# EAGLE design displaycontrol (EAGLE 6.5.2)
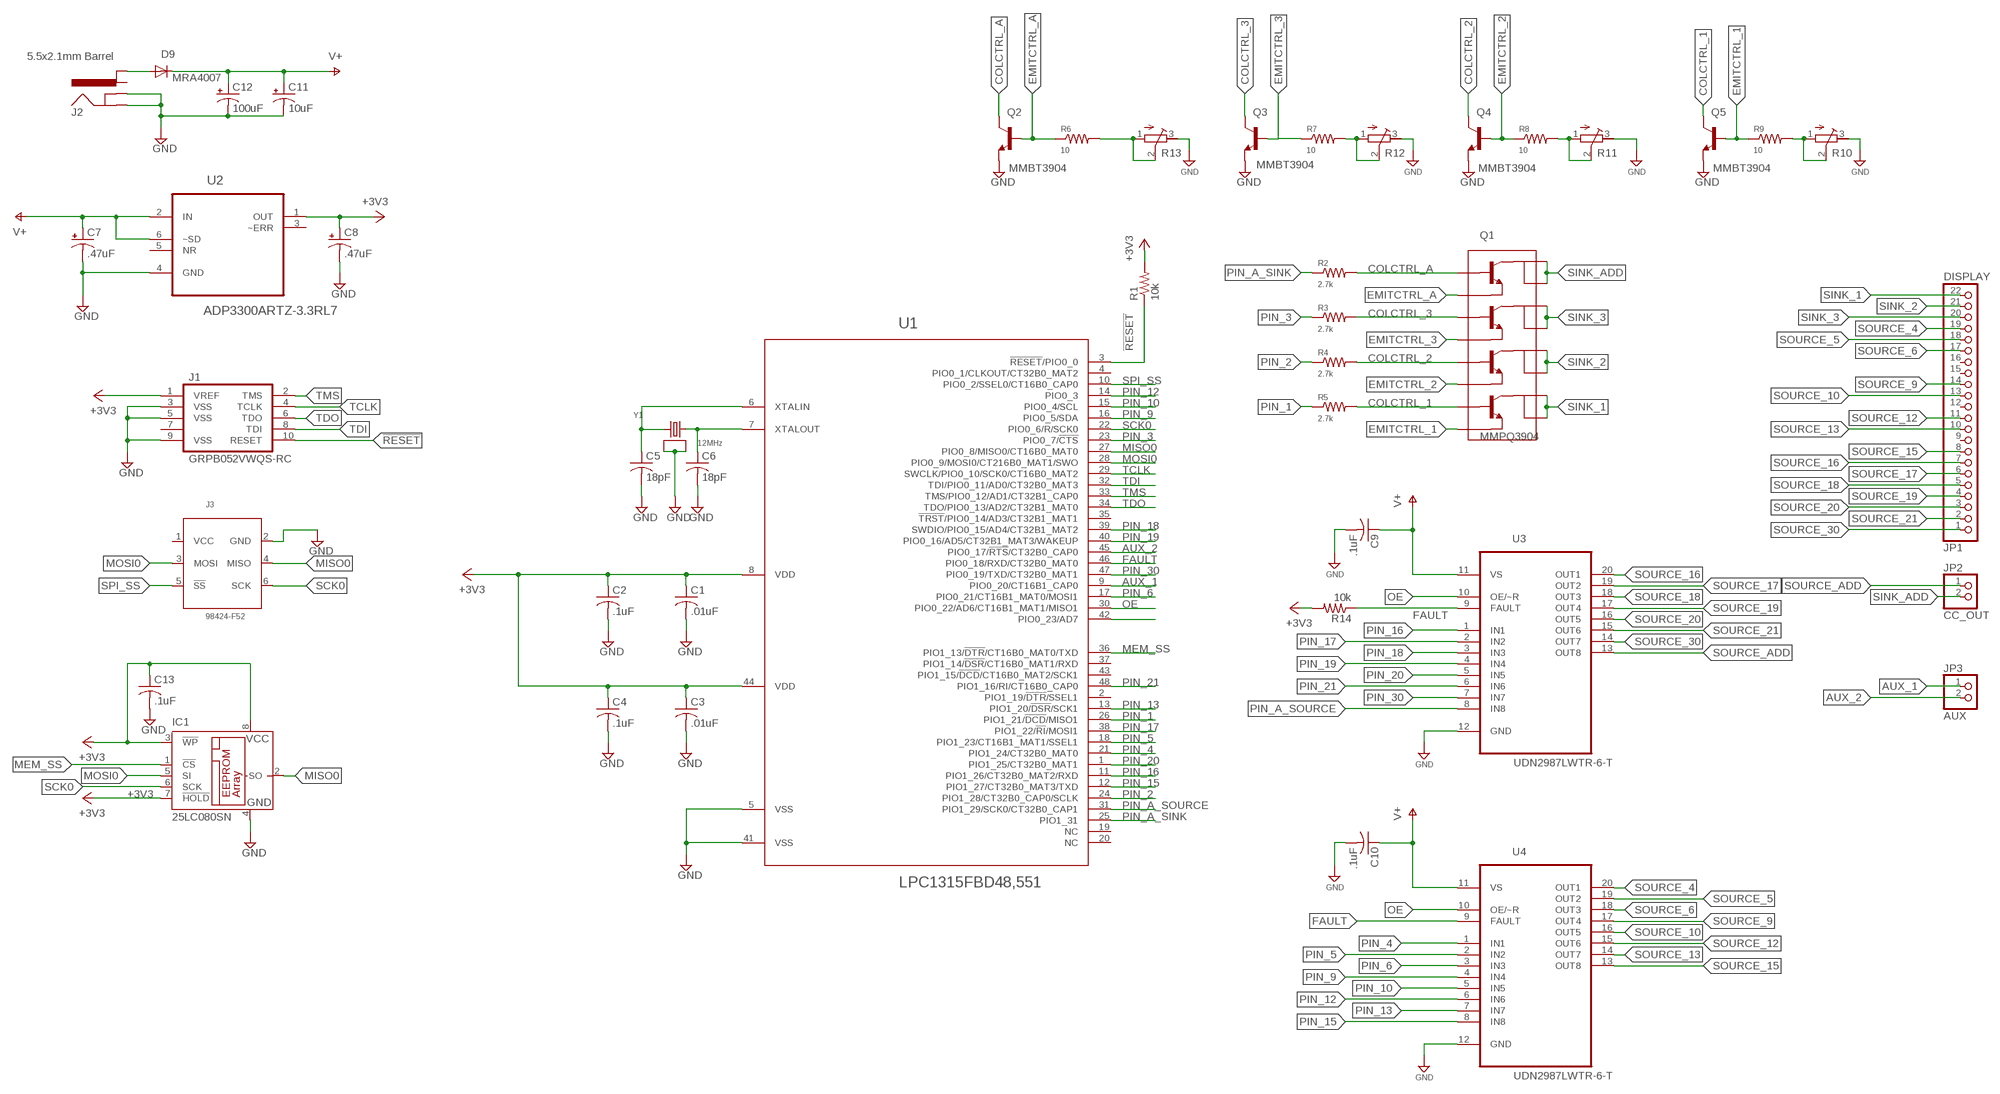
[diagram p0: schematic, sheet 1]

## Parts
C1  .01uF  C-USC0805  [C0805]
C2  .1uF  C-USC0805  [C0805]
C3  .01uF  C-USC0805  [C0805]
C4  .1uF  C-USC0805  [C0805]
C5  18pF  C-USC0805  [C0805]
C6  18pF  C-USC0805  [C0805]
C7  .47uF  CAP_POL1206  [EIA3216]
C8  .47uF  CAP_POL1206  [EIA3216]
C9  .1uF  C-USC0805  [C0805]
C10  .1uF  C-USC0805  [C0805]
C11  10uF  CPOL-US153CLV-0405  [153CLV-0405]
C12  100uF  CPOL-US153CLV-0605  [153CLV-0605]
C13  .1uF  C-USC0805  [C0805]
D9  MRA4007  CGRM4007-G  [SOD-123_MINI-SMA]
IC1  25LC080SN  [SO-08]
J1  GRPB052VWQS-RC  [GRPB052VWQS-RC]
J2  5.5x2.1mm Barrel  POWER_JACKSMD  [POWER_JACK_SMD]
J3  98424-F52  [2X3_2MM_SMD]
JP1  DISPLAY  PINHD-1X22  [1X22]
JP2  CC_OUT  PINHD-1X2  [1X02]
JP3  AUX  PINHD-1X2  [1X02]
Q1  MMPQ3904  [SO16]
Q2  MMBT3904  TRANSISTOR_NPNMMBT2222A  [SOT23-3]
Q3  MMBT3904  TRANSISTOR_NPNMMBT2222A  [SOT23-3]
Q4  MMBT3904  TRANSISTOR_NPNMMBT2222A  [SOT23-3]
Q5  MMBT3904  TRANSISTOR_NPNMMBT2222A  [SOT23-3]
R1  10k  R-US_R0805  [R0805]
R2  2.7k  R-US_R0805  [R0805]
R3  2.7k  R-US_R0805  [R0805]
R4  2.7k  R-US_R0805  [R0805]
R5  2.7k  R-US_R0805  [R0805]
R6  10  R-US_R0805  [R0805]
R7  10  R-US_R0805  [R0805]
R8  10  R-US_R0805  [R0805]
R9  10  R-US_R0805  [R0805]
R10  R-TRIMM3214W  [RTRIM3214W]
R11  R-TRIMM3214W  [RTRIM3214W]
R12  R-TRIMM3214W  [RTRIM3214W]
R13  R-TRIMM3214W  [RTRIM3214W]
R14  10k  R-US_R0805  [R0805]
U1  LPC1315FBD48,551  [QFP50P900X900X160-48N]
U2  ADP3300ARTZ-3.3RL7  [SOT95P275X145-6N]
U3  UDN2987LWTR-6-T  [SO20W]
U4  UDN2987LWTR-6-T  [SO20W]
Y1  12MHz  CRYSTAL.5X3.2MM  [5X3.2MM]

## Nets
!RESET!: J1.10(RESET) R1.1 U1.3(!RESET!/PIO0_0)
+3V3: C1.1 C2.1 C3.1 C4.1 C8.A(+) C13.1 IC1.3(!WP) IC1.7(!HOLD) IC1.8(VCC) J1.1(VREF) R1.2 R14.2 U1.8(VDD) U1.44(VDD) U2.1(OUT)
AUX_1: JP3.1 U1.9(PIO0_20/CT16B1_CAP0)
AUX_2: JP3.2 U1.45(PIO0_17/!RTS!/CT32B0_CAP0)
COLCTRL_1: Q1.9(B4) Q5.3(C) R5.2
COLCTRL_2: Q1.11(B3) Q4.3(C) R4.2
COLCTRL_3: Q1.13(B2) Q3.3(C) R3.2
COLCTRL_A: Q1.15(B1) Q2.3(C) R2.2
EMITCTRL_1: Q1.10(E4) Q5.1(B) R9.1
EMITCTRL_2: Q1.12(E3) Q4.1(B) R8.1
EMITCTRL_3: Q1.14(E2) Q3.1(B) R7.1
EMITCTRL_A: Q1.16(E1) Q2.1(B) R6.1
FAULT: R14.1 U1.46(PIO0_18/RXD/CT32B0_MAT0) U3.9(FAULT) U4.9(FAULT)
GND: C1.2 C2.2 C3.2 C4.2 C5.2 C6.2 C7.C(-) C8.C(-) C9.2 C10.2 C11.- C12.- C13.2 IC1.4(GND) J1.3(VSS) J1.5(VSS) J1.9(VSS) J2.GND(GNDBREAK) J2.P$4(GND) J3.2(GND) Q2.2(E) Q3.2(E) Q4.2(E) Q5.2(E) R10.3(A) R11.3(A) R12.3(A) R13.3(A) U1.5(VSS) U1.41(VSS) U2.4(GND) U3.12(GND) U4.12(GND) Y1.2(GND) Y1.4(GND)
MEM_SS: IC1.1(!CS) U1.36(PIO1_13/!DTR!/CT16B0_MAT0/TXD)
MISO0: IC1.2(SO) J3.4(MISO) U1.27(PIO0_8/MISO0/CT16B0_MAT0)
MOSI0: IC1.5(SI) J3.3(MOSI) U1.28(PIO0_9/MOSI0/CT216B0_MAT1/SWO)
N$1: C6.1 U1.7(XTALOUT) Y1.3
N$2: C5.1 U1.6(XTALIN) Y1.1
N$6: U1.42(PIO0_23/AD7)
N$13: R6.2 R13.1(E) R13.2(S)
N$18: R7.2 R12.1(E) R12.2(S)
N$20: R8.2 R11.1(E) R11.2(S)
N$22: R9.2 R10.1(E) R10.2(S)
N$42: D9.A J2.VIN1(PWR1)
OE: U1.30(PIO0_22/AD6/CT16B1_MAT1/MISO1) U3.10(OE/~R) U4.10(OE/~R)
PIN_1: R5.1 U1.26(PIO1_21/!DCD!/MISO1)
PIN_2: R4.1 U1.24(PIO1_28/CT32B0_CAP0/SCLK)
PIN_3: R3.1 U1.23(PIO0_7/!CTS!)
PIN_4: U1.21(PIO1_24/CT32B0_MAT0) U4.1(IN1)
PIN_5: U1.18(PIO1_23/CT16B1_MAT1/SSEL1) U4.2(IN2)
PIN_6: U1.17(PIO0_21/CT16B1_MAT0/MOSI1) U4.3(IN3)
PIN_9: U1.16(PIO0_5/SDA) U4.4(IN4)
PIN_10: U1.15(PIO0_4/SCL) U4.5(IN5)
PIN_12: U1.14(PIO0_3) U4.6(IN6)
PIN_13: U1.13(PIO1_20/!DSR!/SCK1) U4.7(IN7)
PIN_15: U1.12(PIO1_27/CT32B0_MAT3/TXD) U4.8(IN8)
PIN_16: U1.11(PIO1_26/CT32B0_MAT2/RXD) U3.1(IN1)
PIN_17: U1.38(PIO1_22/!RI!/MOSI1) U3.2(IN2)
PIN_18: U1.39(SWDIO/PIO0_15/AD4/CT32B1_MAT2) U3.3(IN3)
PIN_19: U1.40(PIO0_16/AD5/CT32B1_MAT3/WAKEUP) U3.4(IN4)
PIN_20: U1.1(PIO1_25/CT32B0_MAT1) U3.5(IN5)
PIN_21: U1.48(PIO1_16/RI/CT16B0_CAP0) U3.6(IN6)
PIN_30: U1.47(PIO0_19/TXD/CT32B0_MAT1) U3.7(IN7)
PIN_A_SINK: R2.1 U1.25(PIO1_31)
PIN_A_SOURCE: U1.31(PIO1_29/SCK0/CT32B0_CAP1) U3.8(IN8)
SCK0: IC1.6(SCK) J3.6(SCK) U1.22(PIO0_6/R/SCK0)
SINK_1: JP1.22 Q1.7(C4) Q1.8(C4)
SINK_2: JP1.21 Q1.5(C3) Q1.6(C3)
SINK_3: JP1.20 Q1.3(C2) Q1.4(C2)
SINK_ADD: JP2.2 Q1.1(C1) Q1.2(C1)
SOURCE_4: JP1.19 U4.20(OUT1)
SOURCE_5: JP1.18 U4.19(OUT2)
SOURCE_6: JP1.17 U4.18(OUT3)
SOURCE_9: JP1.14 U4.17(OUT4)
SOURCE_10: JP1.13 U4.16(OUT5)
SOURCE_12: JP1.11 U4.15(OUT6)
SOURCE_13: JP1.10 U4.14(OUT7)
SOURCE_15: JP1.8 U4.13(OUT8)
SOURCE_16: JP1.7 U3.20(OUT1)
SOURCE_17: JP1.6 U3.19(OUT2)
SOURCE_18: JP1.5 U3.18(OUT3)
SOURCE_19: JP1.4 U3.17(OUT4)
SOURCE_20: JP1.3 U3.16(OUT5)
SOURCE_21: JP1.2 U3.15(OUT6)
SOURCE_30: JP1.1 U3.14(OUT7)
SOURCE_ADD: JP2.1 U3.13(OUT8)
SPI_SS: J3.5(!SS!) U1.10(PIO0_2/SSEL0/CT16B0_CAP0)
TCLK: J1.4(TCLK) U1.29(SWCLK/PIO0_10/SCK0/CT16B0_MAT2)
TDI: J1.8(TDI) U1.32(TDI/PIO0_11/AD0/CT32B0_MAT3)
TDO: J1.6(TDO) U1.34(TDO/PIO0_13/AD2/CT32B1_MAT0)
TMS: J1.2(TMS) U1.33(TMS/PIO0_12/AD1/CT32B1_CAP0)
V+: C7.A(+) C9.1 C10.1 C11.+ C12.+ D9.C U2.2(IN) U2.6(~SD) U3.11(VS) U4.11(VS)
Unconnected: J1.7(NC) J2.VIN0(PWR) JP1.9 JP1.12 JP1.15 JP1.16 U1.2(PIO1_19/!DTR!/SSEL1) U1.4(PIO0_1/CLKOUT/CT32B0_MAT2) U1.19(NC) U1.20(NC) U1.35(!TRST!/PIO0_14/AD3/CT32B1_MAT1) U1.37(PIO1_14/!DSR!/CT16B0_MAT1/RXD) U1.43(PIO1_15/!DCD!/CT16B0_MAT2/SCK1) U2.3(~ERR) U2.5(NR)

## Power pins joined to a net without a drawn wire
VCC: J3.1(VCC)

## Library data of the parts
C1-C6 C9 C10 C13 = rcl:C-US: CAPACITOR, American symbol
C7 C8 = SparkFun-Capacitors:CAP_POL: Capacitor Polarized These are standard SMD and PTH capacitors. Normally 10uF, 47uF, and 100uF in electrolytic and tantalum varieties. Always verify the external diameter of the through hole cap, it varies with capacity, voltage, and manufacturer. The EIA devices should be standard.
C11 C12 = rcl:CPOL-US: POLARIZED CAPACITOR, American symbol
D9 = diode:CGRM400*-G: Molded plasitc,JEDEC SOD-123/Mini SMA Source: Comchip CGRM4001-G.pdf
IC1 = microchip:25*: Serial EEPROM 4K/ 8K , SPI bus; MF: MICROCHIP; MPN: 25LC080/SN; OC_FARNELL: 1137302; OC_NEWARK: 96K4092
J1 = switchers:GRPB052VWQS-RC: HEADER - Vertical, Shrouded
J2 = SparkFun-Connectors:POWER_JACK: Power Jack This is the standard 5.5mm barrel jack for power. The PTH is the most common, proven, reliable, footprint. The Slot footprint only works if the mill layer is transmitted to the PCB fab house so be warned. Spark Fun Electronics SKU : PRT-00119 SMT: CONN-08106 Mating wall wart : TOL-00298 (and others); PROD_ID: CONN-08106
J3 = switchers:98424-F52
JP1 = pinhead:PINHD-1X22: PIN HEADER
JP2 JP3 = pinhead:PINHD-1X2: PIN HEADER
Q1 = switchers:MMPQ3904
Q2-Q5 = SparkFun-DiscreteSemi:TRANSISTOR_NPN: Generic NPN BJT MMBT2222A - TRANS-08049 (SOT-23, 1A 40V) MPSA42 - TRANS-09116 (SOT-23, 500mA 300V) MMBT5088LT1G - TRANS-11160 (SOT-23, 50 mA 30V); PROD_ID: TRANS-08049; VALUE: MMBT2222A
R1-R9 R14 = rcl:R-US_: RESISTOR, American symbol
R10-R13 = resistor:R-TRIMM: Trimm resistor
U1 = switchers:LPC1315FBD48,551
U2 = switchers:ADP3300ARTZ-3.3RL7: Low Dropout Linear Regulator; MPN: ADP3300ARTZ-3.3RL7; OC_FARNELL: 1661067; OC_NEWARK: 19M8715; PACKAGE: TSOT-6; SUPPLIER: ANALOG DEVICES
U3 U4 = switchers:UDN2987LWTR-6-T: 8-CHANNEL SOURCE DRIVER WITH OVER-CURRENT PROTECTION
Y1 = abracon:CRYSTAL

## Board
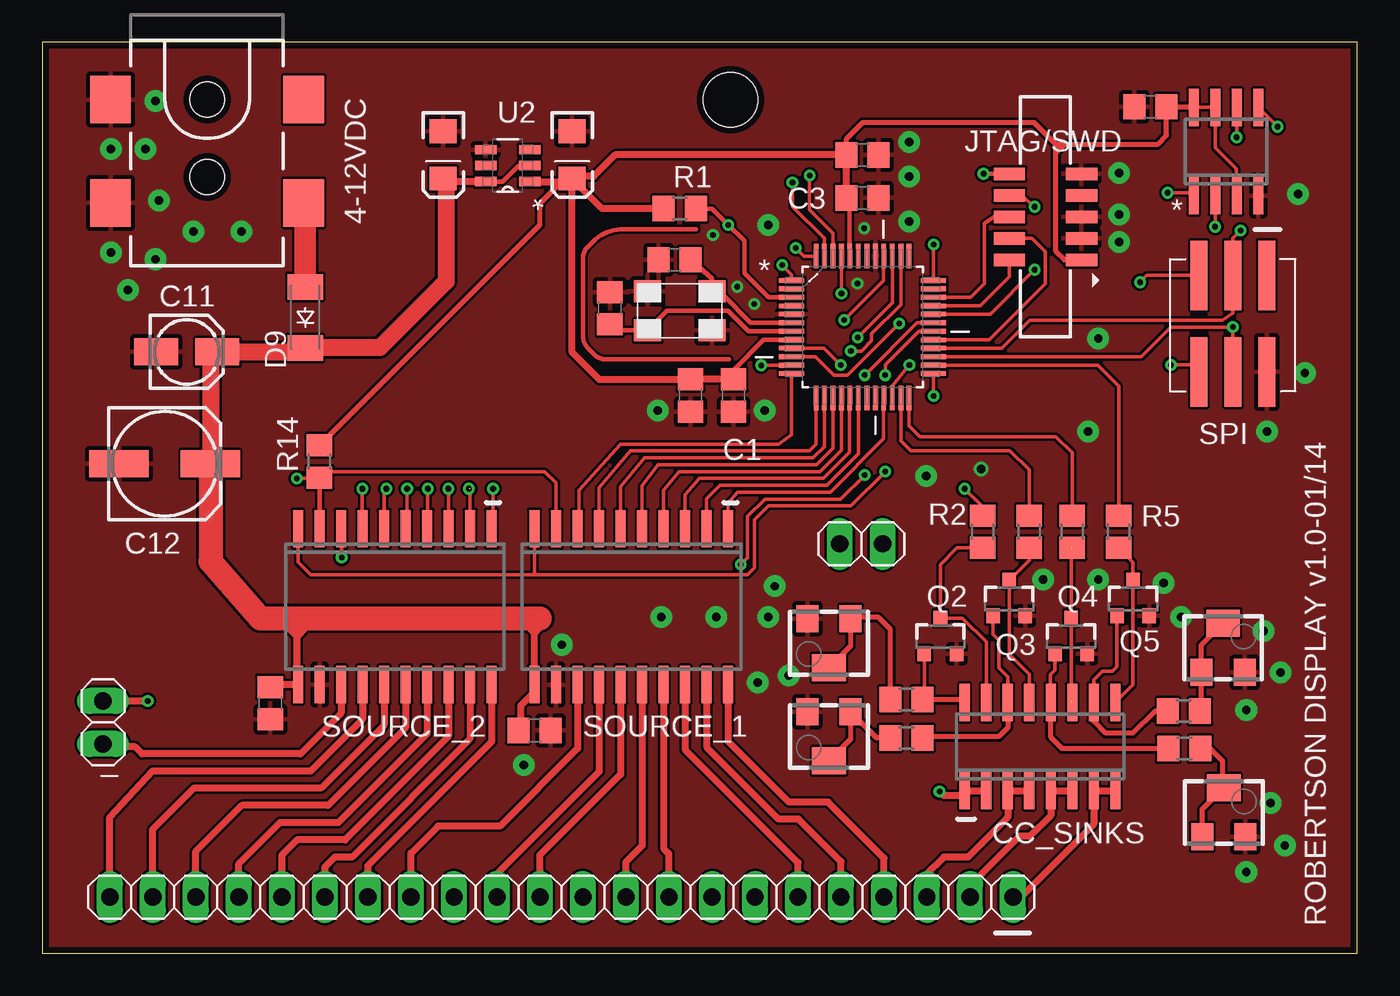
[diagram p1: board, top side]
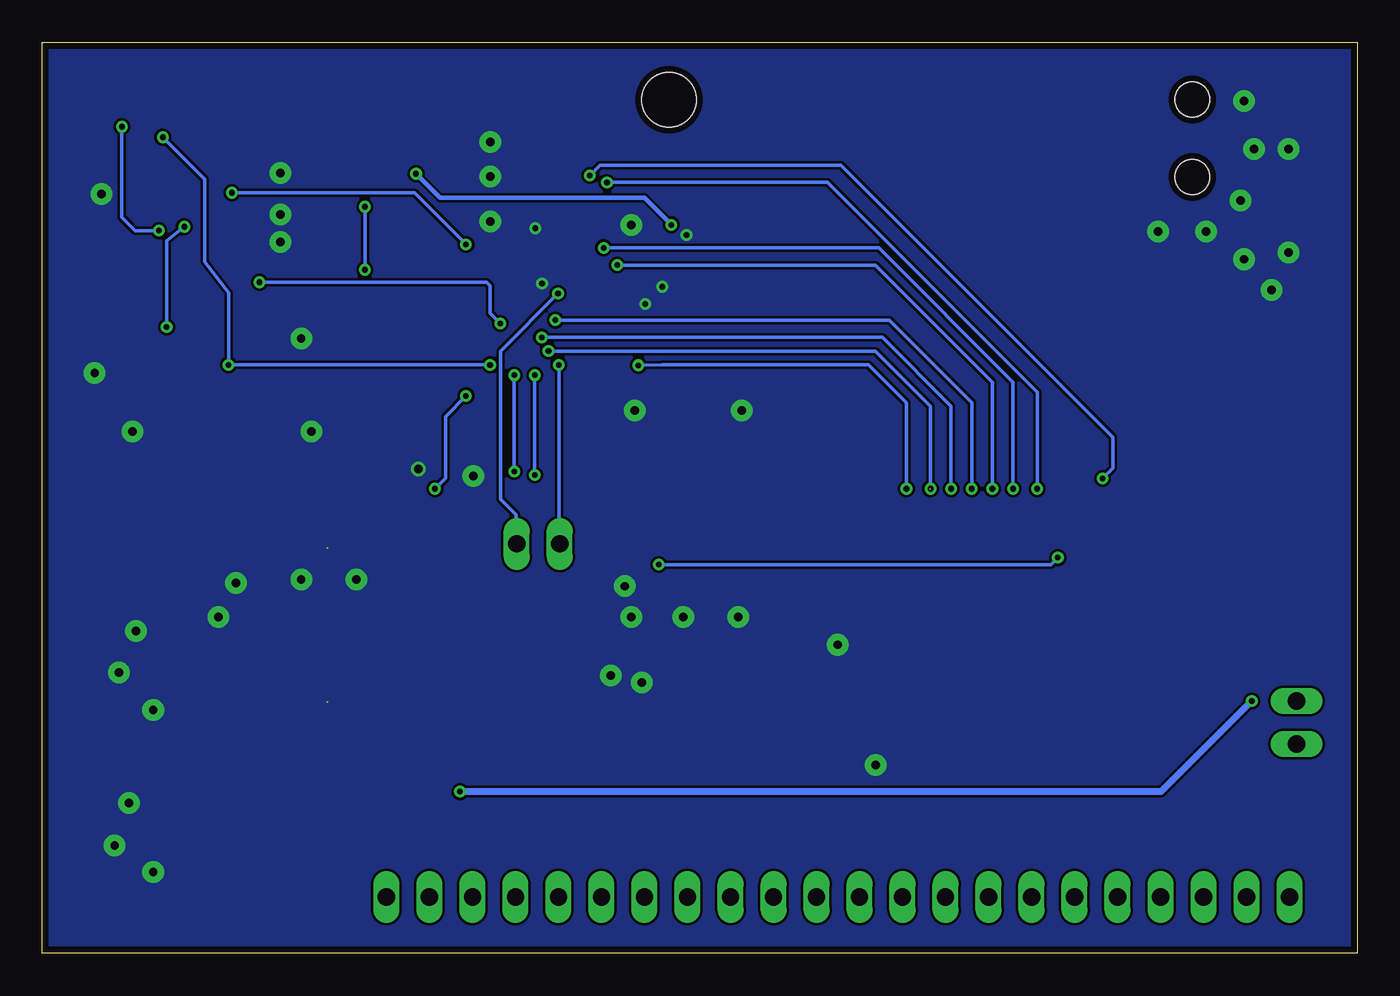
[diagram p2: board, bottom side, seen from below]

Size 77.65 x 53.79 mm. Coordinates in mm from the lower left corner, seen from the top.
Outline: 0,0 77.65,0 77.65,53.79 0,53.79 0,0
Copper layers (1*16): Top 0.0356mm / dielectric 1.5011mm / Bottom 0.0356mm
Design rules "LaenPCBOrder": minimum track width 6mil, minimum drill 13mil, track to track 6mil, track to pad 6mil, pad to pad 6mil, via to via 6mil, smd to smd 6mil, copper to edge 15mil, drill to drill 6mil, minimum pad ring 7mil, minimum via ring 7mil, stop-mask expansion 3mil, vias tented up to drill 0mil, thermal gap 10mil
Holes 3.2 mm at 40.64,50.39

### Footprints (pad centres in the part's own frame; a part is rotated, then mirrored left to right if it is on the bottom)
C0805 = smd 1.3 x 1.5: 1 -0.95,0; 2 0.95,0
EIA3216 = smd 1.4 x 1.6: A 1.4,0; C -1.4,0
153CLV-0405 = smd 2.6 x 1.6: + 1.8,0; - -1.8,0
153CLV-0605 = smd 3.5 x 1.6: + 2.7,0; - -2.7,0
SOD-123_MINI-SMA = smd 1.5 x 2.1: A 1.8,0; C -1.8,0
SO-08 = smd 0.6 x 2.2: 1 -1.905,-2.6; 2 -0.635,-2.6; 3 0.635,-2.6; 4 1.905,-2.6; 5 1.905,2.6; 6 0.635,2.6; 7 -0.635,2.6; 8 -1.905,2.6
GRPB052VWQS-RC = smd 0.74 x 1.85: 1 -2.54,-2.156; 2 -2.54,2.106; 3 -1.27,-2.156; 4 -1.27,2.106; 5 0,-2.156; 6 0,2.106; 7 1.27,-2.156; 8 1.27,2.106; 9 2.54,-2.156; 10 2.54,2.106
POWER_JACK_SMD = smd 2.8 x 2.4: GND 0,-5.7; P$4 6.1,-5.7; VIN0 0,5.7; VIN1 6.1,5.7 | hole 2.032: 0,0; 4.572,0
2X3_2MM_SMD = smd 1 x 4.1: 1 -2,-2.85; 2 -2,2.85; 3 0,-2.85; 4 0,2.85; 5 2,-2.85; 6 2,2.85
1X22 = drill 1.016 long: 1 -26.67,0; 2 -24.13,0; 3 -21.59,0; 4 -19.05,0; 5 -16.51,0; 6 -13.97,0; 7 -11.43,0; 8 -8.89,0; 9 -6.35,0; 10 -3.81,0; 11 -1.27,0; 12 1.27,0; 13 3.81,0; 14 6.35,0; 15 8.89,0; 16 11.43,0; 17 13.97,0; 18 16.51,0; 19 19.05,0; 20 21.59,0; 21 24.13,0; 22 26.67,0
1X02 = drill 1.016 long: 1 -1.27,0; 2 1.27,0
SO16 = smd 0.6 x 2.2: 1 -4.445,-2.6; 2 -3.175,-2.6; 3 -1.905,-2.6; 4 -0.635,-2.6; 5 0.635,-2.6; 6 1.905,-2.6; 7 3.175,-2.6; 8 4.445,-2.6; 9 4.445,2.6; 10 3.175,2.6; 11 1.905,2.6; 12 0.635,2.6; 13 -0.635,2.6; 14 -1.905,2.6; 15 -3.175,2.6; 16 -4.445,2.6
SOT23-3 = smd 0.8 x 0.9: 1 -0.95,-1; 2 0.95,-1; 3 0,1.1
R0805 = smd 1.3 x 1.5: 1 -0.95,0; 2 0.95,0
RTRIM3214W = smd 1.3 x 1.6: 1 -1.275,-1.45; 3 1.275,-1.45 | smd 2 x 1.6: 2 0,1.45
QFP50P900X900X160-48N = smd 1.473 x 0.279: 1 -4.191,2.743; 2 -4.191,2.261; 3 -4.191,1.753; 4 -4.191,1.245; 5 -4.191,0.762; 6 -4.191,0.254; 7 -4.191,-0.254; 8 -4.191,-0.762; 9 -4.191,-1.245; 10 -4.191,-1.753; 11 -4.191,-2.261; 12 -4.191,-2.743; 25 4.191,-2.743; 26 4.191,-2.261; 27 4.191,-1.753; 28 4.191,-1.245; 29 4.191,-0.762; 30 4.191,-0.254; 31 4.191,0.254; 32 4.191,0.762; 33 4.191,1.245; 34 4.191,1.753; 35 4.191,2.261; 36 4.191,2.743 | smd 0.279 x 1.473: 13 -2.743,-4.191; 14 -2.261,-4.191; 15 -1.753,-4.191; 16 -1.245,-4.191; 17 -0.762,-4.191; 18 -0.254,-4.191; 19 0.254,-4.191; 20 0.762,-4.191; 21 1.245,-4.191; 22 1.753,-4.191; 23 2.261,-4.191; 24 2.743,-4.191; 37 2.743,4.191; 38 2.261,4.191; 39 1.753,4.191; 40 1.245,4.191; 41 0.762,4.191; 42 0.254,4.191; 43 -0.254,4.191; 44 -0.762,4.191; 45 -1.245,4.191; 46 -1.753,4.191; 47 -2.261,4.191; 48 -2.743,4.191
SOT95P275X145-6N = smd 1.27 x 0.559: 1 -1.295,0.94; 2 -1.295,0; 3 -1.295,-0.94; 4 1.295,-0.94; 5 1.295,0; 6 1.295,0.94
SO20W = smd 0.6 x 2.2: 1 -5.715,-4.6; 2 -4.445,-4.6; 3 -3.175,-4.6; 4 -1.905,-4.6; 5 -0.635,-4.6; 6 0.635,-4.6; 7 1.905,-4.6; 8 3.175,-4.6; 9 4.445,-4.6; 10 5.715,-4.6; 11 5.715,4.6; 12 4.445,4.6; 13 3.175,4.6; 14 1.905,4.6; 15 0.635,4.6; 16 -0.635,4.6; 17 -1.905,4.6; 18 -3.175,4.6; 19 -4.445,4.6; 20 -5.715,4.6
5X3.2MM = smd 1.6 x 1.3: 1 -1.9,-1.15; 2 1.9,-1.15; 3 1.9,1.15; 4 -1.9,1.15

### Placement (x,y rotation side)
C1  40.82,32.94 270 top
C2  38.28,32.94 270 top
C3  48.44,44.6 0 top
C4  48.44,47.14 0 top
C5  37.33,40.95 180 top
C6  33.52,38.09 90 top
C7  23.67,47.14 270 top
C8  31.29,47.14 270 top
C9  13.46,14.77 270 top
C10  29.07,13.17 0 top
C11  8.53,35.51 0 top
C12  7.23,28.91 0 top
C13  65.43,49.99 180 top
D9  15.53,37.55 90 top
IC1  69.9,47.35 0 top
J1  59.21,43.49 90 top
J2  9.73,50.41 270 top
J3  70.31,37.19 180 top
JP1  30.66,3.33 0 top
JP2  3.58,13.64 90 top
JP3  48.36,24.18 0 top
Q1  58.92,12.22 0 top
Q2  53.04,18.69 0 top
Q3  57.1,20.93 0 top
Q4  60.76,18.69 0 top
Q5  64.41,20.93 0 top
R1  37.64,43.97 180 top
R2  55.54,24.89 270 top
R3  58.28,24.89 270 top
R4  60.82,24.89 270 top
R5  63.56,24.89 270 top
R6  51.03,14.99 180 top
R7  51.03,12.73 180 top
R8  67.44,12.1 0 top
R9  67.42,14.31 0 top
R10  69.73,18.05 0 top
R11  69.78,8.33 0 top
R12  46.46,12.82 180 top
R13  46.46,18.32 180 top
R14  16.37,29.04 90 top
U1  48.44,36.98 0 top
U2  27.48,46.51 180 top
U3  20.82,20.47 180 top
U4  34.79,20.47 180 top
Y1  37.64,37.93 180 top

### Tracks (layer width: path | path; a pad name or v marks a point on that pad's centre or on a via)
!RESET!  (via drill 0.33 pad 0.18)
  Top 0.254: U1.3 42.88,38.73 41.45,40.16 41.45,42.06 v40.5,43.02 39.55,43.97 R1.1 | J1.10 v55.58,46.03
  Bottom 0.254: v55.58,46.03 54.15,44.6 42.09,44.6 v40.5,43.02
+3V3
  Top 0.203: IC1.8 IC1.7 69.27,47.57 70.51,46.33 70.51,44.77 IC1.3
  Top 0.254: U1.8 42.6,36.22 40.82,34.44 C1.1 | U1.44 47.68,44.41
  Top 0.305: 47.68,44.41 C3.1 | C4.1 47.49,48.1 48.44,49.05 58.6,49.05 59.87,47.78 | J1.1 60.35,40.95 59.87,41.43 59.87,47.78 | R14.2 29.39,43.01 29.39,44.3 30.66,45.57 | 60.35,47.75 65.84,47.75 66.38,48.3 C13.1 67.95,49.99 IC1.8 | 60.35,47.75 59.89,47.75 59.87,47.78 | 59.94,47.35 60.35,47.75
  Top 0.406: C1.1 C2.1 32.88,33.89 31.29,35.48 C8.A | C3.1 C4.1 33.83,47.14 32.56,45.87 31.42,45.87 C8.A | U2.1 30.66,45.57 31.12,45.57 C8.A | R1.2 33.07,43.97 C8.A
AUX_1  (via drill 0.33)
  Top 0.203: U1.9 46.15,35.74 v47.14,34.75
  Bottom 0.203: v47.14,34.75 47.14,24.23 JP3.1
AUX_2  (via drill 0.33)
  Top 0.203: U1.45 v47.19,38.96
  Bottom 0.203: v47.19,38.96 50.6,35.56 50.6,26.82 49.68,25.91 49.68,24.23 JP3.2
COLCTRL_1
  Top 0.203: R5.2 64.41,23.09 Q5.3 64.41,15.87 Q1.9
COLCTRL_2  (2 unrouted)
  Top 0.203: 60.76,23.88 Q4.3 60.76,14.88
COLCTRL_3
  Top 0.203: R3.2 58.28,23.21 Q3.3 57.1,17.68 58.28,16.5 Q1.13
COLCTRL_A
  Top 0.203: R2.2 54.02,23.94 53.03,22.96 Q2.3 54.33,19.79 55.74,18.39 Q1.15
EMITCTRL_1
  Top 0.203: Q5.1 63.46,16.93 63.2,16.66 62.59,16.66 62.09,16.17 Q1.10
  Top 0.305: R9.1 65.72,14.31 64.41,13.01 62.79,13.01 62.09,13.7 Q1.10
EMITCTRL_2
  Top 0.203: Q4.1 59.81,16.73 59.54,16.46 59.54,14.83 Q1.12
  Top 0.305: R8.1 60.24,12.1 59.54,12.8 59.54,14.83
EMITCTRL_3
  Top 0.203: Q3.1 56.15,18.83 56.49,18.49 56.49,16.87 57.01,16.34 Q1.14
  Top 0.305: Q1.14 57.01,13.32 56.49,12.8 52.05,12.8 R7.1
EMITCTRL_A
  Top 0.203: Q2.1 52.09,15.1 R6.1 | 54.3,14.99 Q1.16
  Top 0.305: 54.3,14.99 R6.1
FAULT  (via drill 0.33)
  Top 0.203: U4.9 30.34,27.77 29.67,28.45 16.72,28.45 R14.1 16.32,28.04 v15.04,28.04 | U1.46 46.69,42.52 45.31,43.89 v45.31,45.92
  Top 0.254: U3.9 R14.1
  Bottom 0.203: v45.31,45.92 44.7,46.53 30.48,46.53 14.43,30.48 14.43,28.65 v15.04,28.04
GND  (via drill 0.33 pad 0.18, 0.5 pad 0.25, 0.5 pad 1.27)
  other vias: 39.6,42.41 41.03,39.36 42.04,38.34 55.45,28.59 42.86,19.85 44.08,16.4 72.52,8.88 73.37,6.36 73.13,16.6 71.1,14.36 28.43,11.11 51.19,47.89 51.19,45.86 51.19,43.22 52.2,28.18 61.75,30.82 67.24,19.85 66.22,21.88 63.58,46.06 63.58,43.62 63.58,42 30.66,18.22 36.35,32.04 42.65,32.04 48.14,39.56 62.36,36.31 48.55,42.81 72.32,30.82 74.56,34.28 74.15,44.84 4.04,47.49 6.08,47.49 6.89,44.44 8.92,42.61 6.69,50.33 6.69,40.98 11.77,42.61 4.04,41.39 43.26,21.68 42.25,15.99 71.1,4.81 72.12,19.04 42.86,43.01 39.81,19.85 36.56,19.85 5.06,39.15 59.11,22.09 62.36,22.09
  pour Top (rank 2): 0,53.77 0,-0.2 77.44,0 77.44,53.98
  pour Bottom (rank 2): 0,53.98 0,0 77.44,0 77.44,53.98
MEM_SS  (via drill 0.33)
  Top 0.203: U1.36 v52.63,41.86 | 68.07,45.31 68.07,44.82 IC1.1 67.83,44.91 v66.45,44.91
  Bottom 0.203: v52.63,41.86 55.68,44.91 v66.45,44.91
MISO0  (via drill 0.33)
  Top 0.203: U1.27 64.9,35.23 66.65,36.98 v70.31,36.98 J3.4 | IC1.2 v69.27,42.9
  Bottom 0.203: v69.27,42.9 70.31,42.06 v70.31,36.98
MOSI0  (via drill 0.33)
  Top 0.203: U1.28 56.67,35.74 58.32,37.39 69.7,37.39 70.31,37.8 J3.3 70.31,42.22 v70.76,42.67 | IC1.5 v72.95,48.8
  Bottom 0.203: v70.76,42.67 72.17,42.67 72.95,43.45 v72.95,48.8
N$1
  Top 0.254: U1.7 41.71,36.73 40.5,37.94 36.89,37.94 Y1.3 33.87,36.78 arc-90 C6.1
  Top 0.305: 35.74,36.46 Y1.3
N$2
  Top 0.254: U1.6 41.83,37.24 40.18,38.89 39.66,38.89
  Top 0.305: 39.66,38.89 Y1.1 39.54,39.84 C5.1
N$4
  Top 0.254: 38.6,42.74 34.15,42.74 arc45 32.53,42.03 32.19,41.69 arc45 31.93,41.05 31.93,36.54 arc45 32.2,35.76 32.62,35.34 arc45 33.25,35.08 40.56,35.08
N$13
  Top 0.305: 46.57,16.98 R13.2 47.73,18.14 R13.1 47.8,19.84 49.39,19.84 50.08,19.15 R6.2
N$18
  Top 0.305: R12.2 47.73,12.64 R12.1 49.27,12.73 R7.2
N$20
  Top 0.305: R11.1 68.5,8.5 R11.2 69.7,9.86 69.7,11.38 68.98,12.1 R8.2
N$22
  Top 0.305: R9.2 68.45,14.39 R10.1 68.45,18.23 R10.2
N$42
  Top 1.27: J2.VIN1 15.53,44.31 D9.A
OE  (via drill 0.33)
  Top 0.203: U3.10 15.1,23.1 15.85,22.35 29.06,22.35 | 29.06,22.35 29.06,25.06 U4.10 | U1.30 51.77,36.73 49.78,34.75 v49.78,34.14 | v49.78,28.45 47.75,26.42 42.88,26.42 42.06,25.6 42.06,22.76 41.66,22.35 29.06,22.35
  Bottom 0.203: v49.78,34.14 v49.78,28.45
PIN_1
  Top 0.203: U1.26 62.33,34.72 63.56,33.49 R5.1
PIN_2
  Top 0.203: U1.24 51.18,31.15 51.82,30.52 59.87,30.52 60.82,29.57 R4.1
PIN_3
  Top 0.203: U1.23 50.7,30.28 51.3,29.68 57.15,29.68 58.28,28.55 R3.1
PIN_4
  Top 0.203: U4.1 40.5,26.58 41.05,27.23 46.53,27.23 49.68,30.38 U1.21
PIN_5
  Top 0.203: U4.2 39.23,26.84 40.03,27.64 46.33,27.64 48.18,29.49 U1.18
PIN_6
  Top 0.203: U4.3 37.96,27.09 38.81,28.04 46.13,28.04 47.68,29.59 U1.17
PIN_9
  Top 0.203: U4.4 36.69,27.34 37.59,28.45 45.92,28.45 47.19,29.72 U1.16
PIN_10
  Top 0.203: U4.5 35.42,27.6 36.37,28.85 45.72,28.85 46.69,29.82 U1.15
PIN_12
  Top 0.203: U4.6 34.15,27.55 35.56,29.26 45.52,29.26 46.18,29.92 U1.14
PIN_13
  Top 0.203: U4.7 32.88,27.5 34.75,29.67 45.31,29.67 45.7,30.05 U1.13
PIN_15
  Top 0.203: U1.12 44.25,30.63 43.48,30.07 34.14,30.07 31.7,27.33 31.7,25.16 U4.8
PIN_16  (via drill 0.33 pad 0.18)
  Top 0.203: U1.11 v42.44,34.72 | v26.62,27.43 26.62,25.16 U3.1
  Bottom 0.203: v42.44,34.72 41.05,34.75 28.85,34.75 26.62,32.51 v26.62,27.43
PIN_17  (via drill 0.33, 0.33 pad 0.18)  (1 unrouted)
  Top 0.203: U3.2 25.26,27.43 | v47.75,35.56 48.36,35.56 48.97,36.17 48.97,36.58 50.7,38.3 U1.38
  Bottom 0.203: v47.75,35.56 28.45,35.56 25.2,32.31 v25.2,27.43
PIN_18  (via drill 0.33 pad 0.18)
  Top 0.203: U1.39 50.19,38.41 v48.16,36.37 | U3.3 v23.99,27.42 v23.98,27.43
  Bottom 0.203: v48.16,36.37 28.04,36.37 23.98,32.31 v23.98,27.43
PIN_19  (via drill 0.33 pad 0.18)
  Top 0.203: U1.40 49.68,39.73 v47.35,37.39 | v22.76,27.43 22.76,25.11 U3.4
  Bottom 0.203: v47.35,37.39 27.64,37.39 22.76,32.51 v22.76,27.43
PIN_20  (via drill 0.33 pad 0.18)
  Top 0.203: U1.1 44.25,40.08 v43.69,40.64 | v21.54,27.43 21.54,25.16 U3.5
  Bottom 0.203: v43.69,40.64 28.45,40.64 21.54,33.73 v21.54,27.43
PIN_21  (via drill 0.33 pad 0.18)
  Top 0.203: v44.5,41.66 44.98,41.17 U1.48 | v20.32,27.43 20.18,27.29 U3.6
  Bottom 0.203: v44.5,41.66 28.25,41.66 20.32,33.73 v20.32,27.43
PIN_30  (via drill 0.33)
  Top 0.203: v18.9,27.43 18.9,25.09 U3.7 | U1.47 46.18,42.22 44.3,44.09 v44.3,45.52
  Bottom 0.203: v44.3,45.52 31.29,45.52 18.9,33.12 v18.9,27.43
PIN_A_SINK  (via drill 0.33)
  Top 0.203: U1.25 v52.63,32.92 | R2.1 55.47,26.42 v54.46,27.43
  Bottom 0.203: v52.63,32.92 53.85,31.7 53.85,28.04 v54.46,27.43
PIN_A_SOURCE  (via drill 0.33)
  Top 0.203: U1.31 51.66,37.24 v48.56,34.14 | v48.56,28.25 47.14,26.82 42.67,26.82 41.66,25.81 41.66,23.37 v41.25,22.96 | v17.68,23.37 17.68,25.03 U3.8
  Bottom 0.203: v48.56,34.14 v48.56,28.25 | v41.25,22.96 18.09,22.96 v17.68,23.37
SCK0  (via drill 0.33)
  Top 0.203: U1.22 50.19,33.53 v51.21,34.75 | v66.65,34.75 68.3,34.75 J3.6 | IC1.6 v70.54,48.18
  Bottom 0.203: v51.21,34.75 v66.65,34.75 66.65,39.01 68.07,40.84 68.07,45.72 v70.54,48.18
SINK_1
  Top 0.406: Q1.8 Q1.7 62.09,7.63 57.78,3.33 JP1.22
SINK_2
  Top 0.406: Q1.6 Q1.5 59.55,8.14 58.32,6.91 57.71,6.91 54.79,3.99 JP1.21
SINK_3
  Top 0.406: Q1.4 Q1.3 57.01,8.04 54.66,5.69 53.24,5.69 52.25,4.7 JP1.20
SINK_ADD  (via drill 0.33)
  Top 0.406: Q1.2 Q1.1 54.47,9.35 53.18,9.35 v52.98,9.55 | JP2.2 v6.22,14.91
  Bottom 0.406: v6.22,14.91 11.58,9.55 v52.98,9.55
SOURCE_4
  Top 0.406: U4.20 40.5,12.54 44.09,8.94 46.4,8.94 49.71,5.63 JP1.19
SOURCE_5
  Top 0.406: U4.19 39.23,12.18 43.48,7.92 44.67,7.92 47.17,5.42 JP1.18
SOURCE_6
  Top 0.406: U4.18 37.96,12.03 44.63,5.36 JP1.17
SOURCE_9
  Top 0.406: U4.17 36.69,6.18 36.98,5.89 36.98,3.35 JP1.14
SOURCE_10
  Top 0.406: U4.16 35.42,6.36 34.47,5.41 JP1.13
SOURCE_12
  Top 0.406: U4.15 34.15,10.58 29.39,5.82 JP1.11
SOURCE_13
  Top 0.406: U4.14 32.88,10.73 26.85,4.7 JP1.10
SOURCE_15
  Top 0.406: U4.13 31.61,12.1 27.03,7.52 23.37,7.52 21.77,5.92 JP1.8
SOURCE_16
  Top 0.406: U3.20 26.53,12.51 19.23,5.21 JP1.7
SOURCE_17
  Top 0.406: U3.19 25.26,12.66 18.29,5.69 17.27,5.69 16.69,5.11 JP1.6
SOURCE_18
  Top 0.406: U3.18 23.99,12.81 17.88,6.71 15.04,6.71 14.15,5.82 JP1.5
SOURCE_19
  Top 0.406: U3.17 22.72,12.97 17.48,7.72 14.02,7.72 11.61,5.31 JP1.4
SOURCE_20
  Top 0.406: U3.16 21.45,13.32 16.87,8.74 11.79,8.74 9.07,6.02 JP1.3
SOURCE_21
  Top 0.406: U3.15 20.18,13.47 16.46,9.75 8.94,9.75 6.53,7.34 JP1.2
SOURCE_30
  Top 0.406: U3.14 18.91,13.83 15.85,10.77 6.5,10.77 3.99,8.05 JP1.1
SOURCE_ADD
  Top 0.406: U3.13 17.64,14.19 15.24,11.79 5.89,11.79 5.49,12.19 3.76,12.19 JP2.1
SPI_SS  (via drill 0.33)
  Top 0.203: v64.82,39.62 65.23,40.03 J3.5 | U1.10 45.64,35.23 46.74,34.14 47.55,34.14 v50.6,37.19
  Bottom 0.203: v64.82,39.62 51.41,39.62 51.21,39.42 51.21,37.8 v50.6,37.19
TCLK
  Top 0.203: U1.29 55.93,36.22 59.23,39.52 59.23,41.43 58.44,42.22 J1.4
TDI  (via drill 0.33 pad 0.18)
  Top 0.203: U1.32 55.98,37.74 v58.6,40.36 | J1.8 57.81,44.76 v58.6,44.08
  Bottom 0.203: v58.6,40.36 v58.6,44.08
TDO
  Top 0.203: U1.34 54.84,38.73 55.63,39.52 55.63,43.1 56.21,43.49 J1.6
TMS
  Top 0.203: U1.33 55.4,38.23 57.11,39.94 J1.2
V+
  Top 0.254: U2.2 28.12,46.51 27.18,45.57 U2.6
  Top 0.406: U2.6 23.85,45.57 C7.A | 15.04,18.69 15.04,16.46 U3.11 13.61,15.87 C9.1 | 15.04,18.69 15.04,19.1 15.44,19.79 | 29.06,18.9 29.06,16.46 29.07,16.45 U4.11 29.07,15.46 28.25,14.63 28.25,13.29 C10.1 | 29.06,18.9 29.06,19.79 | 15.04,18.69 14.43,19.3 | 15.04,18.69 15.65,19.3 | 29.06,18.9 28.65,19.3 | 29.06,18.9 29.46,19.3
  Top 1.016: C12.+ 9.93,35.51 C11.+ 15.53,35.51 D9.C 15.54,35.76 19.93,35.76 23.85,39.68 23.85,45.57
  Top 1.422: C12.+ 9.93,23.14 12.88,19.79 15.44,19.79 29.06,19.79 29.39,19.79

### Text on the board
tPlace: JTAG/SWD | 4-12VDC | * | SPI | SOURCE_2 | SOURCE_1 | _ | CC_SINKS
tNames: ROBERTSON DISPLAY v1.0-01/14
tValues: 1 | A | 3 | 2